# EAGLE design micro amp_dual_buff (EAGLE 6.4)
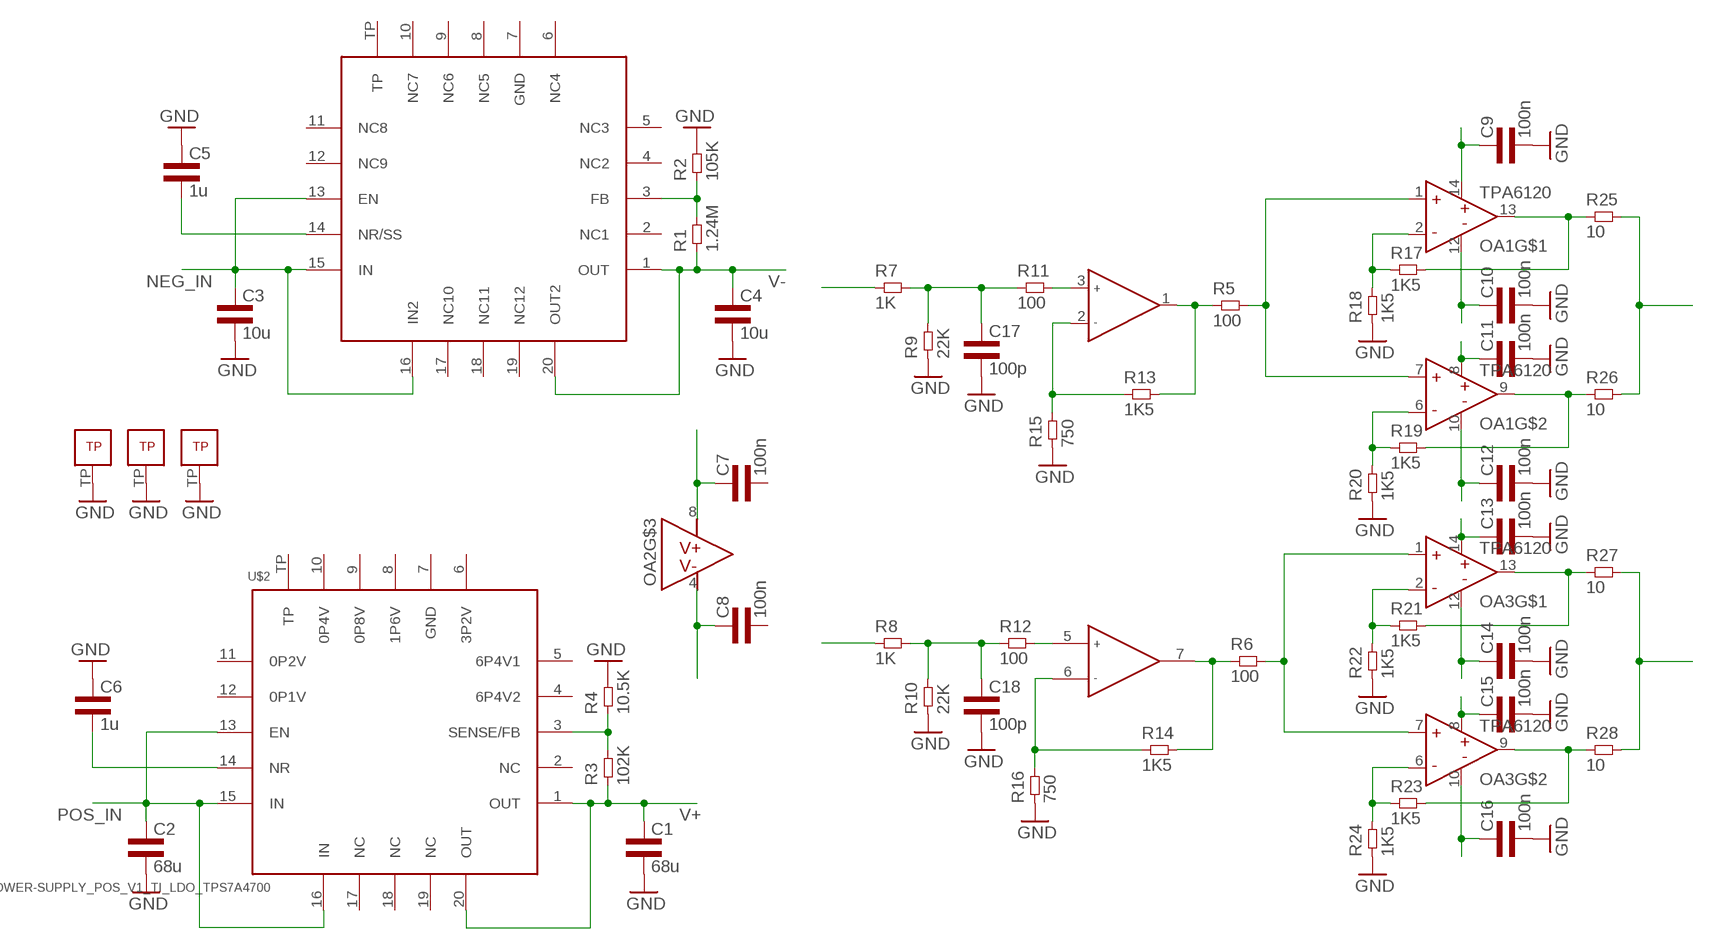
[diagram p0: schematic, sheet 1]

## Parts
C1  68u  CAP1210L3  [1210L3]
C2  68u  CAP1210L3  [1210L3]
C3  10u  CAP0805L3  [0805L3]
C4  10u  CAP0805L3  [0805L3]
C5  1u  CAP0603L3  [0603L3]
C6  1u  CAP0603L3  [0603L3]
C7  100n  CAP0402L3  [0402L3]
C8  100n  CAP0402L3  [0402L3]
C9  100n  CAP0402L3  [0402L3]
C10  100n  CAP0402L3  [0402L3]
C11  100n  CAP0402L3  [0402L3]
C12  100n  CAP0402L3  [0402L3]
C13  100n  CAP0402L3  [0402L3]
C14  100n  CAP0402L3  [0402L3]
C15  100n  CAP0402L3  [0402L3]
C16  100n  CAP0402L3  [0402L3]
C17  100p  CAP0402L3  [0402L3]
C18  100p  CAP0402L3  [0402L3]
OA1  TPA6120QFN  [S-PVQFN-N14]
OA2  OPA1612  [S-PWSON-N8]
OA3  TPA6120QFN  [S-PVQFN-N14]
R1  1.24M  RES0402L3  [0402L3]
R2  105K  RES0402L3  [0402L3]
R3  102K  RES0402L3  [0402L3]
R4  10.5K  RES0402L3  [0402L3]
R5  100  RES0402L3  [0402L3]
R6  100  RES0402L3  [0402L3]
R7  1K  RES0402L3  [0402L3]
R8  1K  RES0402L3  [0402L3]
R9  22K  RES0402L3  [0402L3]
R10  22K  RES0402L3  [0402L3]
R11  100  RES0402L3  [0402L3]
R12  100  RES0402L3  [0402L3]
R13  1K5  RES0402L3  [0402L3]
R14  1K5  RES0402L3  [0402L3]
R15  750  RES0402L3  [0402L3]
R16  750  RES0402L3  [0402L3]
R17  1K5  RES0402L3  [0402L3]
R18  1K5  RES0402L3  [0402L3]
R19  1K5  RES0402L3  [0402L3]
R20  1K5  RES0402L3  [0402L3]
R21  1K5  RES0402L3  [0402L3]
R22  1K5  RES0402L3  [0402L3]
R23  1K5  RES0402L3  [0402L3]
R24  1K5  RES0402L3  [0402L3]
R25  10  RES0805L3  [0805L3]
R26  10  RES0805L3  [0805L3]
R27  10  RES0805L3  [0805L3]
R28  10  RES0805L3  [0805L3]
U$1  POWER-SUPPLY_POS_V1_TI_LDO_TPS7A3301RGWT  [POWER-SUPPLY_POS_V1_TI_LDO_VQFN-20]
U$2  POWER-SUPPLY_POS_V1_TI_LDO_TPS7A4700  [POWER-SUPPLY_POS_V1_TI_LDO_VQFN-20]

## Nets
GND: C1.P$2 C2.P$2 C3.2 C4.2 C5.P$1 C6.P$1 C9.P$2 C10.P$2 C11.P$2 C12.P$2 C13.P$2 C14.P$2 C15.P$2 C16.P$2 C17.P$2 C18.P$2 OA1.TP OA2.TP OA3.TP R2.P$2 R4.P$2 R9.P$1 R10.P$1 R15.P$1 R16.P$1 R18.P$1 R20.P$1 R22.P$1 R24.P$1
IN_L: R7.P$1
IN_R: R8.P$1
N$1: R3.P$2 R4.P$1 U$2.3(SENSE/FB)
N$2: R1.P$2 R2.P$1 U$1.3(FB)
N$3: C5.P$2 U$1.14(NR/SS)
N$4: C6.P$2 U$2.14(NR)
N$13: OA1.1(IN+) OA1.7(IN+) R5.P$2
N$14: OA3.1(IN+) OA3.7(IN+) R6.P$2
N$48: OA2.1(OUTA) R5.P$1 R13.P$2
N$49: OA2.7(OUTB) R6.P$1 R14.P$2
N$50: C18.P$1 R8.P$2 R10.P$2 R12.P$1
N$51: C17.P$1 R7.P$2 R9.P$2 R11.P$1
N$54: OA2.3(INA+) R11.P$2
N$55: OA2.5(INB+) R12.P$2
N$56: OA2.2(INA-) R13.P$1 R15.P$2
N$57: OA2.6(INB-) R14.P$1 R16.P$2
N$58: OA1.13(OUT) R17.P$2 R25.1
N$59: OA1.9(OUT) R19.P$2 R26.1
N$60: OA3.13(OUT) R21.P$2 R27.1
N$61: OA3.9(OUT) R23.P$2 R28.1
N$62: OA1.2(IN-) R17.P$1 R18.P$2
N$63: OA1.6(IN-) R19.P$1 R20.P$2
N$64: OA3.2(IN-) R21.P$1 R22.P$2
N$65: OA3.6(IN-) R23.P$1 R24.P$2
NEG_IN: C3.1 U$1.13(EN) U$1.15(IN) U$1.16(IN2)
OUT_L: R25.2 R26.2
OUT_R: R27.2 R28.2
POS_IN: C2.P$1 U$2.13(EN) U$2.15(IN) U$2.16(IN)
V+: C1.P$1 C7.P$1 C9.P$1 C11.P$1 C13.P$1 C15.P$1 OA1.8(V+) OA1.14(V+) OA2.8(V+) OA3.8(V+) OA3.14(V+) R3.P$1 U$2.1(OUT) U$2.20(OUT)
V-: C4.1 C8.P$1 C10.P$1 C12.P$1 C14.P$1 C16.P$1 OA1.10(V-) OA1.12(V-) OA2.4(V-) OA3.10(V-) OA3.12(V-) R1.P$1 U$1.1(OUT) U$1.20(OUT2)
Unconnected: C7.P$2 C8.P$2 U$1.2(NC1) U$1.4(NC2) U$1.5(NC3) U$1.6(NC4) U$1.7(GND) U$1.8(NC5) U$1.9(NC6) U$1.10(NC7) U$1.11(NC8) U$1.12(NC9) U$1.17(NC10) U$1.18(NC11) U$1.19(NC12) U$1.TP U$2.2(NC) U$2.4(6P4V2) U$2.5(6P4V1) U$2.6(3P2V) U$2.7(GND) U$2.8(1P6V) U$2.9(0P8V) U$2.10(0P4V) U$2.11(0P2V) U$2.12(0P1V) U$2.17(NC) U$2.18(NC) U$2.19(NC) U$2.TP

## Library data of the parts
C1-C18 = common:CAP
OA1 OA3 = common:TPA6120
OA2 = common:OPA1612
R1-R28 = common:RES
U$1 = my_dac_amp:POWER-SUPPLY_POS_V1_TI_LDO_TPS7A3301RGWT: Ultra-Low Noise NEGATIVE Voltage Reglator
U$2 = my_dac_amp:POWER-SUPPLY_POS_V1_TI_LDO_TPS7A4700

## Board
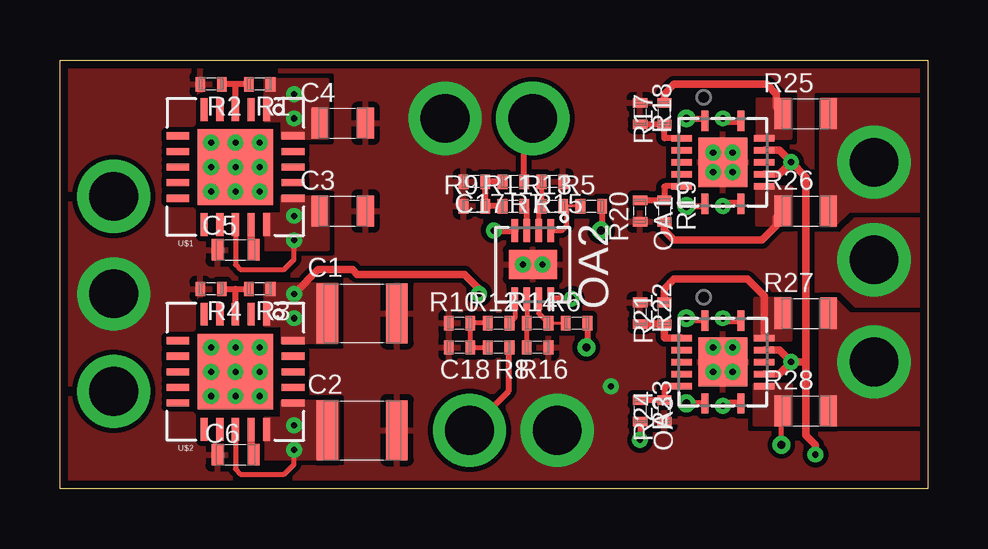
[diagram p1: board, top side]
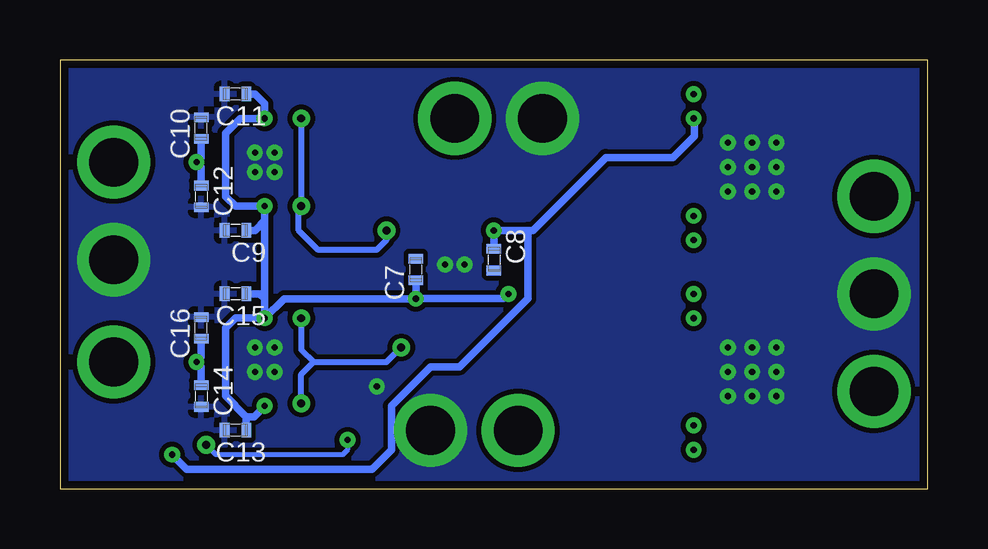
[diagram p2: board, bottom side, seen from below]

Size 36.17 x 17.88 mm. Coordinates in mm from the lower left corner, seen from the top.
Outline: 0,17.88 36.17,17.88 36.17,0 0,0 0,17.88
Copper layers (1*16): Top 0.035mm / dielectric 1.5mm / Bottom 0.035mm
Design rules "default *": minimum track width 10mil, minimum drill 24mil, track to track 8mil, track to pad 8mil, pad to pad 8mil, via to via 8mil, smd to smd 8mil, copper to edge 13mil, drill to drill 8mil, minimum pad ring 10mil, minimum via ring 8mil, stop-mask expansion 4mil, vias tented up to drill 0mil, thermal gap 10mil

### Footprints (pad centres in the part's own frame; a part is rotated, then mirrored left to right if it is on the bottom)
1210L3 = smd 0.9 x 2.5: P$1 -1.45,0; P$2 1.45,0
0805L3 = smd 0.7 x 1.3: 1 -0.95,0; 2 0.95,0
0603L3 = smd 0.5 x 0.9: P$1 -0.75,0; P$2 0.75,0
0402L3 = smd 0.4 x 0.6: P$1 -0.45,0; P$2 0.45,0
S-PVQFN-N14 = smd 0.85 x 0.28: 1 -1.725,-0.75; 7 1.725,-0.75; 8 1.725,0.75; 14 -1.725,0.75 | smd 0.28 x 0.85: 2 -1,-1.725; 3 -0.5,-1.725; 4 0,-1.725; 5 0.5,-1.725; 6 1,-1.725; 9 1,1.725; 10 0.5,1.725; 11 0,1.725; 12 -0.5,1.725; 13 -1,1.725 | smd 2.05 x 2.05: TP 0,0
S-PWSON-N8 = smd 0.28 x 0.95: 1 -0.75,-1.425; 2 -0.25,-1.425; 3 0.25,-1.425; 4 0.75,-1.425; 5 0.75,1.425; 6 0.25,1.425; 7 -0.25,1.425; 8 -0.75,1.425 | smd 2 x 1.2: TP 0,0
POWER-SUPPLY_POS_V1_TI_LDO_VQFN-20 = smd 0.3 x 0.95: 1 -1.3,-2.4; 2 -0.65,-2.4; 3 0,-2.4; 4 0.65,-2.4; 5 1.3,-2.4; 11 1.3,2.4; 12 0.65,2.4; 13 0,2.4; 14 -0.65,2.4; 15 -1.3,2.4 | smd 0.95 x 0.3: 6 2.4,-1.3; 7 2.4,-0.65; 8 2.4,0; 9 2.4,0.65; 10 2.4,1.3; 16 -2.4,1.3; 17 -2.4,0.65; 18 -2.4,0; 19 -2.4,-0.65; 20 -2.4,-1.3 | smd 3.15 x 3.15: TP 0,0

### Placement (x,y rotation side)
C1  12.6,7.32 0 top
C2  12.6,2.44 0 top
C3  11.79,11.58 0 top
C4  11.79,15.24 0 top
C5  7.32,9.96 0 top
C6  7.32,1.42 0 top
C7  21.34,9.14 90 bottom
C8  18.08,9.55 270 bottom
C9  28.85,10.77 180 bottom
C10  30.28,15.04 90 bottom
C11  28.85,16.46 180 bottom
C12  30.28,12.19 270 bottom
C13  28.85,2.44 180 bottom
C14  30.28,3.86 270 bottom
C15  28.85,8.13 180 bottom
C16  30.28,6.71 90 bottom
C17  17.27,12.8 180 top
C18  16.66,5.89 180 top
OA1  27.64,13.61 270 top
OA2  19.71,9.35 180 top
OA3  27.64,5.28 270 top
R1  8.33,16.87 180 top
R2  6.3,16.87 180 top
R3  8.33,8.33 180 top
R4  6.3,8.33 180 top
R5  22.15,11.79 0 top
R6  21.54,6.91 0 top
R7  18.9,12.8 180 top
R8  18.29,5.89 180 top
R9  17.27,11.79 0 top
R10  16.66,6.91 0 top
R11  18.9,11.79 0 top
R12  18.29,6.91 0 top
R13  20.52,11.79 0 top
R14  19.91,6.91 0 top
R15  20.52,12.8 180 top
R16  19.91,5.89 180 top
R17  25.2,15.65 90 top
R18  24.18,15.65 270 top
R19  25.2,11.58 270 top
R20  24.18,11.58 90 top
R21  25.2,7.32 90 top
R22  24.18,7.32 270 top
R23  24.18,3.25 270 top
R24  25.2,3.25 90 top
R25  31.09,15.65 0 top
R26  31.09,11.58 0 top
R27  31.09,7.32 0 top
R28  31.09,3.25 0 top
U$1  7.32,13.41 180 top
U$2  7.32,4.88 180 top

### Tracks (layer width: path | path; a pad name or v marks a point on that pad's centre or on a via)
GND  (via drill 0.25, 2.03)
  other vias: 33.93,9.55 2.24,8.13 16.05,15.44 20.73,2.44 27.23,5.89 28.04,5.89 27.23,4.88 28.04,4.88 27.23,14.02 28.04,14.02 27.23,13.21 28.04,13.21 6.3,14.43 6.3,13.41 6.3,12.4 7.32,12.4 8.33,12.4 8.33,13.41 7.32,13.41 8.33,14.43 7.32,14.43 6.3,3.86 7.32,3.86 8.33,3.86 8.33,4.88 7.32,4.88 6.3,4.88 6.3,5.89 7.32,5.89 8.33,5.89 19.3,9.35 20.12,9.35 22.96,4.27
  pour Bottom (rank 6): 0.41,17.48 35.76,17.48 35.76,0.41 0.41,0.41
  pour Top (rank 6): 0.41,17.48 35.76,17.48 35.76,0.41 0.41,0.41
IN_L  (via drill 2.03)
  Top 0.254: R7.P$1 19.35,15.08 v19.71,15.44
IN_R  (via drill 2.03)
  Top 0.254: R8.P$1 18.69,5.85 18.69,4.06 v17.07,2.44
N$1
  Top 0.254: R4.P$1 7.32,8.33 | 7.32,8.33 R3.P$2 | U$2.3 7.32,8.33
N$2
  Top 0.254: R1.P$2 7.32,16.87 | 7.32,16.87 R2.P$1 | U$1.3 7.32,16.87
N$3
  Top 0.305: U$1.14 7.97,10.06 C5.P$2
N$4
  Top 0.305: U$2.14 7.97,1.52 C6.P$2
N$13  (via drill 0.33)
  Top 0.254: R5.P$2 22.6,10.81 v22.56,10.77 | v26.11,11.79 26.78,11.79 OA1.7 | v26.11,15.44 26.78,15.44 OA1.1
  Bottom 0.254: v26.11,15.44 v26.11,11.79 26.21,11.68 26.21,10.77 25.4,9.96 22.96,9.96 22.56,10.36 v22.56,10.77
N$14  (via drill 0.33)
  Top 0.254: R6.P$2 21.99,5.94 v21.95,5.89 | OA3.1 26.21,7.01 v26.11,7.11 | OA3.7 v26.11,3.56 26.11,3.45
  Bottom 0.254: v26.11,7.11 26.11,5.79 25.6,5.28 | 25.6,5.28 22.56,5.28 v21.95,5.89 | v26.11,3.56 26.11,4.77 25.6,5.28
N$48
  Top 0.127: R5.P$1 R13.P$2
  Top 0.203: OA2.1 20.93,10.77 21.13,10.97 21.13,11.63 R13.P$2
N$49
  Top 0.127: R14.P$2 R6.P$1
  Top 0.203: OA2.7 19.96,7.31 R14.P$2
N$50
  Top 0.203: R12.P$1 R10.P$2 C18.P$1 R8.P$2
N$51
  Top 0.254: R11.P$1 R9.P$2 C17.P$1 R7.P$2
N$54
  Top 0.254: OA2.3 19.46,11.67 R11.P$2
N$55
  Top 0.203: OA2.5 18.96,7.13 R12.P$2
N$56
  Top 0.203: OA2.2 19.96,11.67 R13.P$1 R15.P$2
N$57
  Top 0.203: OA2.6 R14.P$1 R16.P$2
N$58
  Top 0.305: R17.P$2 25.2,16.46 25.6,16.87 29.46,16.87 29.87,16.46 29.87,15.92 R25.1
  pour Top (no thermals): 29.06,14.63 30.48,14.63 30.48,16.26 29.06,16.26
N$59
  Top 0.305: R19.P$2 25.2,10.77 25.6,10.36 29.26,10.36 29.87,10.97 29.87,11.31 R26.1
  pour Top (no thermals): 29.06,12.6 30.48,12.6 30.48,10.97 29.06,10.97
N$60
  Top 0.305: OA3.13 29.36,8.03 28.65,8.74 25.6,8.74 25.2,8.33 R21.P$2
  pour Top (no thermals): 28.96,6.2 30.48,6.2 30.48,7.92 28.96,7.92
N$61  (via drill 0.25, 0.33)
  Top 0.127: 30.07,3.19 R28.1
  Top 0.203: R23.P$2 v24.18,2.03 | v30.07,1.83 30.07,3.19
  Bottom 0.203: v24.18,2.03 24.18,1.63 24.38,1.42 29.67,1.42 v30.07,1.83
  pour Top (no thermals): 28.96,4.37 30.48,4.37 30.48,2.64 28.96,2.64
N$62
  Top 0.254: OA1.2 25.21,14.61 25.2,14.63 R17.P$1 R18.P$2
N$63
  Top 0.254: OA1.6 25.21,12.61 25.2,12.6 R19.P$1 R20.P$2
N$64
  Top 0.305: R22.P$2 R21.P$1 25.2,6.3 25.21,6.28 OA3.2
N$65
  Top 0.254: OA3.6 25.21,4.28 25.2,4.27 R24.P$2 R23.P$1
N$72  (via drill 2.03)
  other vias: 2.24,12.19
N$73  (via drill 2.03)
  other vias: 2.24,4.06
NEG_IN  (via drill 0.25)
  Top 0.203: U$1.13 7.32,9.35 7.52,9.14 9.35,9.14 9.75,9.55 v9.75,10.36
  other vias: 9.75,11.38
  pour Top (no thermals): 8.53,11.48 9.25,11.48 9.25,12.19 11.18,12.19 11.18,9.96 8.53,9.96
OUT_L  (via drill 2.03)
  other vias: 33.93,13.61
  pour Top (no thermals): 31.7,10.97 32.31,10.97 32.92,11.58 35.97,11.58 35.97,16.26 31.7,16.26
OUT_R  (via drill 2.03)
  other vias: 33.93,5.28
  pour Top (no thermals): 31.7,7.92 32.31,7.92 32.92,7.32 35.97,7.32 35.97,2.64 31.7,2.64
POS_IN  (via drill 0.25)
  Top 0.203: U$2.13 7.32,0.81 7.52,0.61 9.35,0.61 9.75,1.02 v9.75,1.63
  other vias: 9.75,2.64
  pour Top (no thermals): 8.53,2.95 9.25,2.95 9.25,3.66 11.58,3.66 11.58,1.22 8.53,1.22
V+  (via drill 0.25)
  Top 0.305: OA1.14 27.64,15.34 v27.64,15.44 | OA1.8 27.64,11.89 v27.64,11.79 | OA2.8 v21.33,7.92 v21.34,7.93 | OA3.8 27.74,3.56 v27.64,3.45 | OA3.14 27.74,7.01 v27.64,7.11 | v17.48,8.13 17.48,8.33 16.87,8.94 12.4,8.94 12.19,9.14 10.77,9.14 v9.75,8.13
  Bottom 0.305: C9.P$1 28.04,10.77 27.64,11.18 v27.64,11.79 | C11.P$1 28.04,16.46 27.64,16.05 v27.64,15.44 28.65,15.44 29.26,14.83 29.26,12.19 28.85,11.79 v27.64,11.79 | v21.33,7.92 26.82,7.92 v27.64,7.11 | C13.P$1 28.4,3 | 28.4,3 29.26,3.86 29.26,6.71 28.85,7.11 v27.64,7.11 | 28.4,3 28.09,3 v27.64,3.45 | v27.64,11.79 27.64,7.93 | 27.64,7.93 v27.64,7.11 | C15.P$1 27.84,8.13 27.64,7.93 | v17.48,8.13 17.68,7.93 v21.34,7.93 C7.P$1
  other vias: 9.75,7.11
  pour Top (no thermals): 8.53,6.81 9.25,6.81 9.25,6.1 11.58,6.1 11.58,8.53 8.53,8.53
V-  (via drill 0.25)
  Top 0.305: OA2.4 v18.09,10.77 v18.08,10.77 | OA1.12 29.98,14.11 v30.48,13.61 | OA1.10 29.98,13.11 v30.48,13.61 | OA3.12 29.98,5.78 v30.48,5.28 | OA3.10 29.98,4.78 v30.48,5.28 | v31.5,1.42 31.5,1.83 31.09,2.23 31.09,5.28 | v30.48,13.61 31.09,13.01 31.09,5.28 | 31.09,5.28 v30.48,5.28
  Bottom 0.305: C8.P$1 v18.08,10.77 | v18.09,10.77 16.66,10.77 | 16.66,10.77 16.46,10.77 13.41,13.82 10.61,13.82 U$1.20 9.72,15.41 v9.75,15.44 | 16.66,10.77 16.66,7.93 19.51,5.08 20.73,5.08 22.35,3.45 22.35,1.63 23.16,0.81 30.89,0.81 v31.5,1.42 | C10.P$1 30.28,13.82 v30.48,13.61 30.28,13.41 C12.P$1 | C16.P$1 30.28,5.49 v30.48,5.28 30.28,5.08 C14.P$1
  other vias: 9.75,16.46
  pour Top (no thermals): 9.25,14.63 11.18,14.63 11.18,17.07 8.53,17.07 8.53,15.34 9.25,15.34